# Altium schematic sheet STM32-PROX_5.SchDoc
size 261 x 179 mm
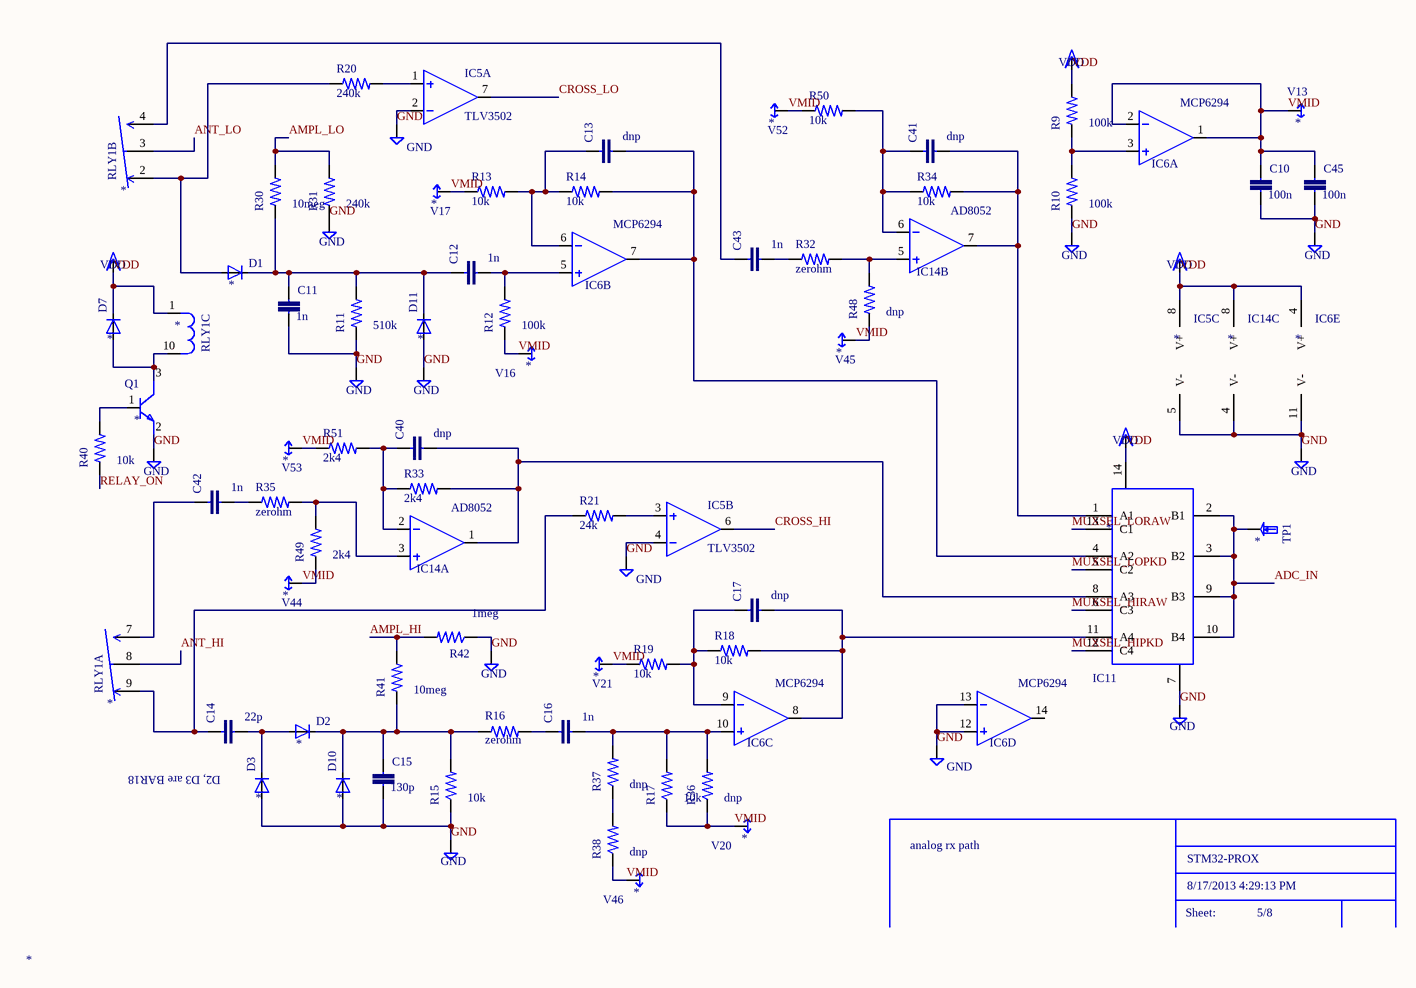
[diagram p0: STM32-PROX_5.SchDoc]

## Parts
C10  100n  [RLC_0603]
C11  1n  [RLC_0603]
C12  1n  [RLC_0603]
C13  dnp  [RLC_0603]
C14  22p  [RLC_0603]
C15  130p  [RLC_0603]
C16  1n  [RLC_0603]
C17  dnp  [RLC_0603]
C40  dnp  [RLC_0603]
C41  dnp  [RLC_0603]
C42  1n  [RLC_0603]
C43  1n  [RLC_0603]
C45  100n  [RLC_0603]
D1  *  [SOT23-3LEAD]
D2  *  [SOT23-3LEAD]
D3  *  [SOT23-3LEAD]
D7  *  [SOT23-3LEAD]
D10  *  [SOT23-3LEAD]
D11  *  [SOT23-3LEAD]
FRAME4  *
IC5  TLV3502  [SOT-23-8-OR-MSOP-8]  (parts A,B,C of 3)
IC6  MCP6294  [TSSOP-14]  (parts A,B,C,D,E of 5)
IC11  *  [TSSOP-14]
IC14  AD8052  [MSOP8]  (parts A,B,C of 3)
Q1  *  [SOT23-3LEAD]
R9  100k  [RLC_0603]
R10  100k  [RLC_0603]
R11  510k  [RLC_0603]
R12  100k  [RLC_0603]
R13  10k  [RLC_0603]
R14  10k  [RLC_0603]
R15  10k  [RLC_0603]
R16  zerohm  [RLC_0603]
R17  10k  [RLC_0603]
R18  10k  [RLC_0603]
R19  10k  [RLC_0603]
R20  240k  [RLC_0603]
R21  24k  [RLC_0603]
R30  10meg  [RLC_0603]
R31  240k  [RLC_0603]
R32  zerohm  [RLC_0603]
R33  2k4  [RLC_0603]
R34  10k  [RLC_0603]
R35  zerohm  [RLC_0603]
R36  dnp  [RLC_0603]
R37  dnp  [RLC_0603]
R38  dnp  [RLC_0603]
R40  10k  [RLC_0603]
R41  10meg  [RLC_0603]
R42  1meg  [RLC_0603]
R48  dnp  [RLC_0603]
R49  2k4  [RLC_0603]
R50  10k  [RLC_0603]
R51  2k4  [RLC_0603]
RLY1  *  [TQ-SMD-RELAY]  (parts A,B,C of 3)
TP1  *  [KEYSTONE-SMD-TESTPOINT-5015]
V13  *
V14  GND
V15  GND
V16  *
V17  *
V18  GND
V19  GND
V20  *
V21  *
V22  GND
V23  GND
V33  GND
V34  GND
V42  GND
V43  GND
V44  *
V45  *
V46  *
V48  GND
V49  GND
V52  *
V53  *
V56  GND
VDD2  VDD
VDD3  VDD
VDD8  VDD
VDD9  VDD

## Nets
ADC_IN: IC11.2(B1) IC11.3(B2) IC11.9(B3) IC11.10(B4) TP1.1(P$1)
AMPL_HI: R41.2 R42.2
AMPL_LO: R30.2 R31.2
ANT_HI: RLY1.8(COM)
ANT_LO: RLY1.3(COM)
CROSS_HI: IC5.6(OUT)
CROSS_LO: IC5.7(OUT)
GND: C10.2 C11.2 C15.2 C45.2 D3.1(A) D10.1(A) D11.1(A) IC5.2(-IN) IC5.4(-IN) IC5.5(V-) IC6.11(V-) IC6.12(+IN) IC6.13(-IN) IC11.7(VSS) IC14.4(V-) Q1.2(E) R10.1 R11.1 R15.1 R31.1 R42.1 V14.0(GND) V15.0(GND) V18.0(GND) V19.0(GND) V22.0(GND) V23.0(GND) V33.0(GND) V34.0(GND) V42.0(GND) V43.0(GND) V48.0(GND) V49.0(GND) V56.0(GND)
MUXSEL_HIPKD: IC11.12(C4)
MUXSEL_HIRAW: IC11.6(C3)
MUXSEL_LOPKD: IC11.5(C2)
MUXSEL_LORAW: IC11.13(C1)
RELAY_ON: R40.1
VDD: D7.3(C) IC5.8(V+) IC6.4(V+) IC11.14(VDD) IC14.8(V+) R9.2 RLY1.1(P$1) VDD2.0(VDD) VDD3.0(VDD) VDD8.0(VDD) VDD9.0(VDD)
VMID: C10.1 C45.1 IC6.1(OUT) IC6.2(-IN) R12.1 R13.1 R17.1 R19.1 R36.1 R38.1 R48.1 R49.1 R50.1 R51.1 V13.0(VMID) V16.0(VMID) V17.0(VMID) V20.0(VMID) V21.0(VMID) V44.0(VMID) V45.0(VMID) V46.0(VMID) V52.0(VMID) V53.0(VMID)
NetC11_1: C11.1 C12.1 D1.3(C) D11.3(C) R11.2 R30.1
NetC12_2: C12.2 IC6.5(+IN) R12.2
NetC13_1: C13.1 IC6.6(-IN) R13.2 R14.1
NetC13_2: C13.2 IC6.7(OUT) IC11.4(A2) R14.2
NetC14_1: C14.1 R21.1 RLY1.9(NC)
NetC14_2: C14.2 D2.1(A) D3.3(C)
NetC15_1: C15.1 D2.3(C) D10.3(C) R15.2 R16.1 R41.1
NetC16_1: C16.1 R16.2
NetC16_2: C16.2 IC6.10(+IN) R17.2 R36.2 R37.2
NetC17_1: C17.1 IC6.9(-IN) R18.1 R19.2
NetC17_2: C17.2 IC6.8(OUT) IC11.11(A4) R18.2
NetC40_1: C40.1 IC14.2(-IN) R33.1 R51.2
NetC40_2: C40.2 IC11.8(A3) IC14.1(OUT) R33.2
NetC41_1: C41.1 IC14.6(-IN) R34.1 R50.2
NetC41_2: C41.2 IC11.1(A1) IC14.7(OUT) R34.2
NetC42_1: C42.1 RLY1.7(NO)
NetC42_2: C42.2 R35.1
NetC43_1: C43.1 RLY1.4(NO)
NetC43_2: C43.2 R32.1
NetD1_1: D1.1(A) R20.1 RLY1.2(NC)
NetD7_1: D7.1(A) Q1.3(C) RLY1.10(P$2)
NetIC5_1: IC5.1(+IN) R20.2
NetIC5_3: IC5.3(+IN) R21.2
NetIC6_3: IC6.3(+IN) R9.1 R10.2
NetIC14_3: IC14.3(+IN) R35.2 R49.2
NetIC14_5: IC14.5(+IN) R32.2 R48.2
NetQ1_1: Q1.1(B) R40.2
NetR37_1: R37.1 R38.2

Not connected (* = marked no-connect by the designer): IC6 14(OUT)

## Notes on the sheet
- D2, D3 are BAR18
- analog rx path
- (in symbol A4L-LOC) STM32-PROX; 8/17/2013 4:29:13 PM; Sheet:; 5/8

## Library data of the parts
C10-C17 C40-C43 C45 = CAPACITOR0603
D1-D3 D7 D10 D11 = DIODE-SMD-SOT23
FRAME4 = A4L-LOC
IC5 = COMP-TLV3502SOT-23-8-OR-MSOP-8
IC6 = OPAMP-TLC2274
IC11 = CD4066
IC14 = OPAMP-AD8052
Q1 = NPN-SOT23-2N3904
R9-R21 R30-R38 R40-R42 R48-R51 = RESISTOR0603
RLY1 = RELAY-DPDT
TP1 = TESTPADKEYSTONE-SMD
V13 V16 V17 V20 V21 V44-V46 V52 V53 = SUPPLY_VMID